# EasyEDA Pro project StimFilterV1.eprj, schematic Schematic1

## Sheets
1 P1: Board Name: Board1; Create Date: 2025-09-26; Page Name: P1; Project Name: StimFilterV1; Schematic Name: Schematic1; Update Date: 2025-09-27; Company: EasyEDA.com; Page Size: A4; Version: V1.0
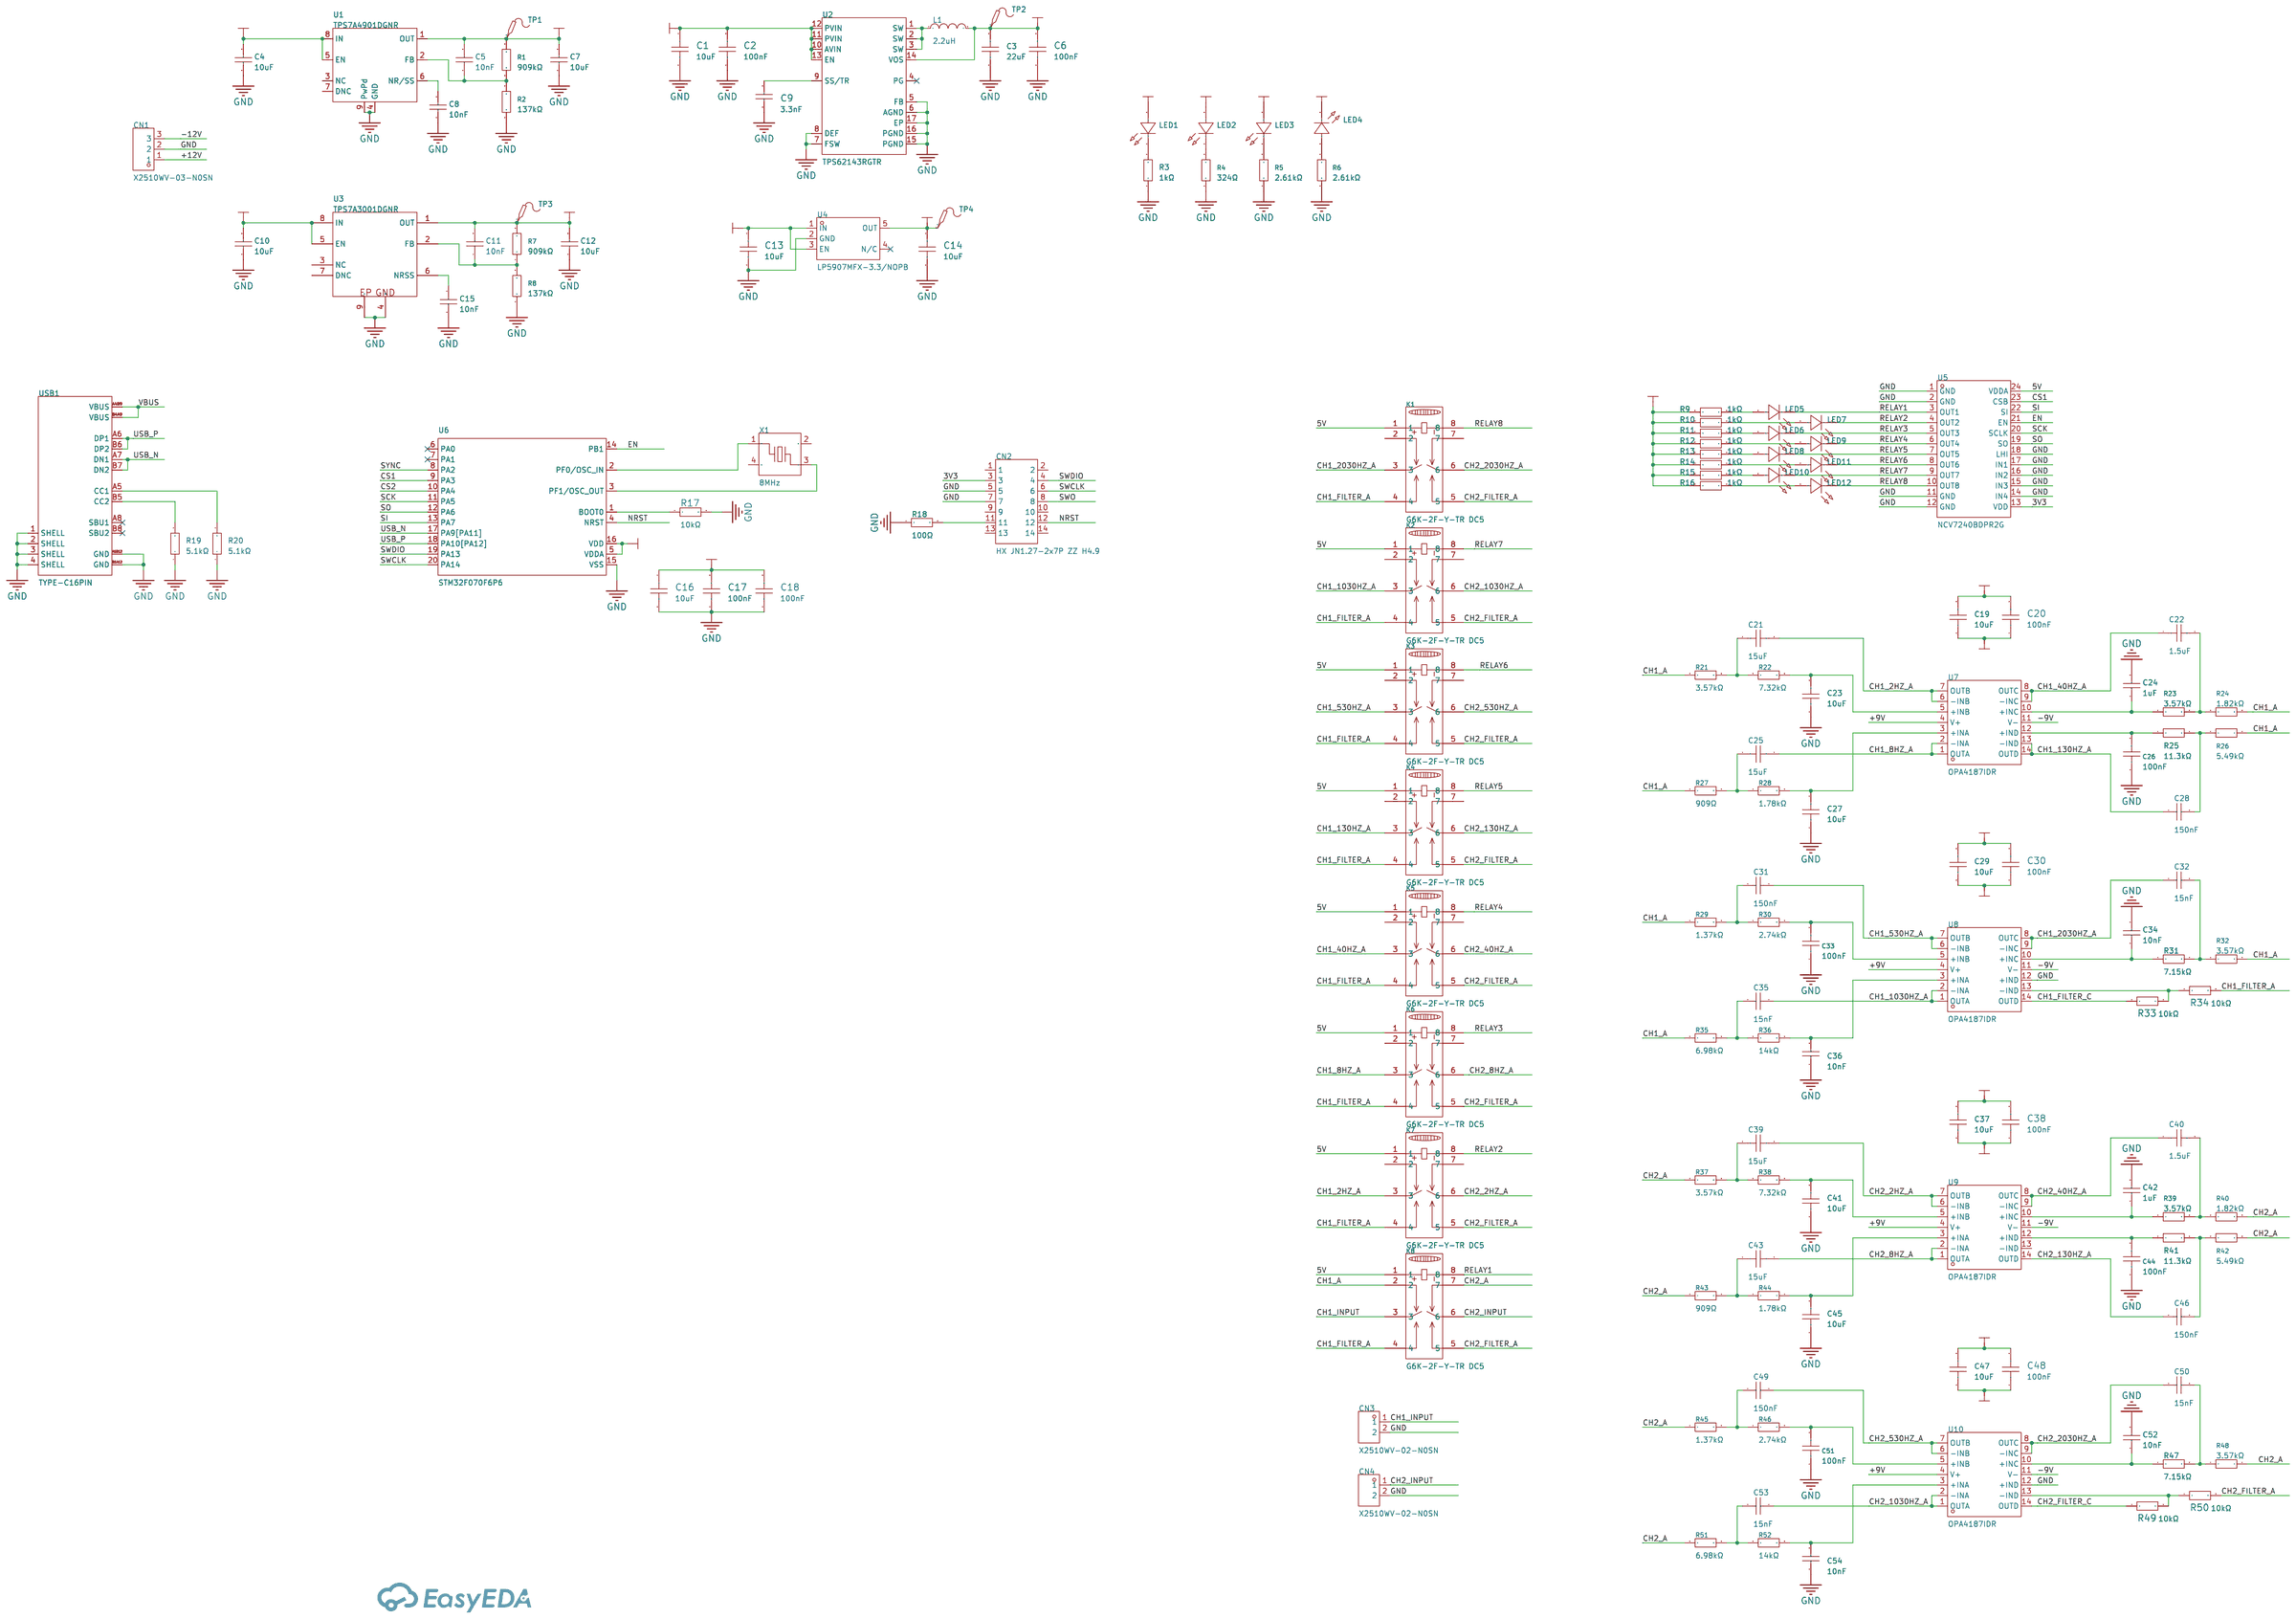
[diagram p0: P1]
2 P2: Create Date: 2025-09-27; Page Name: P2
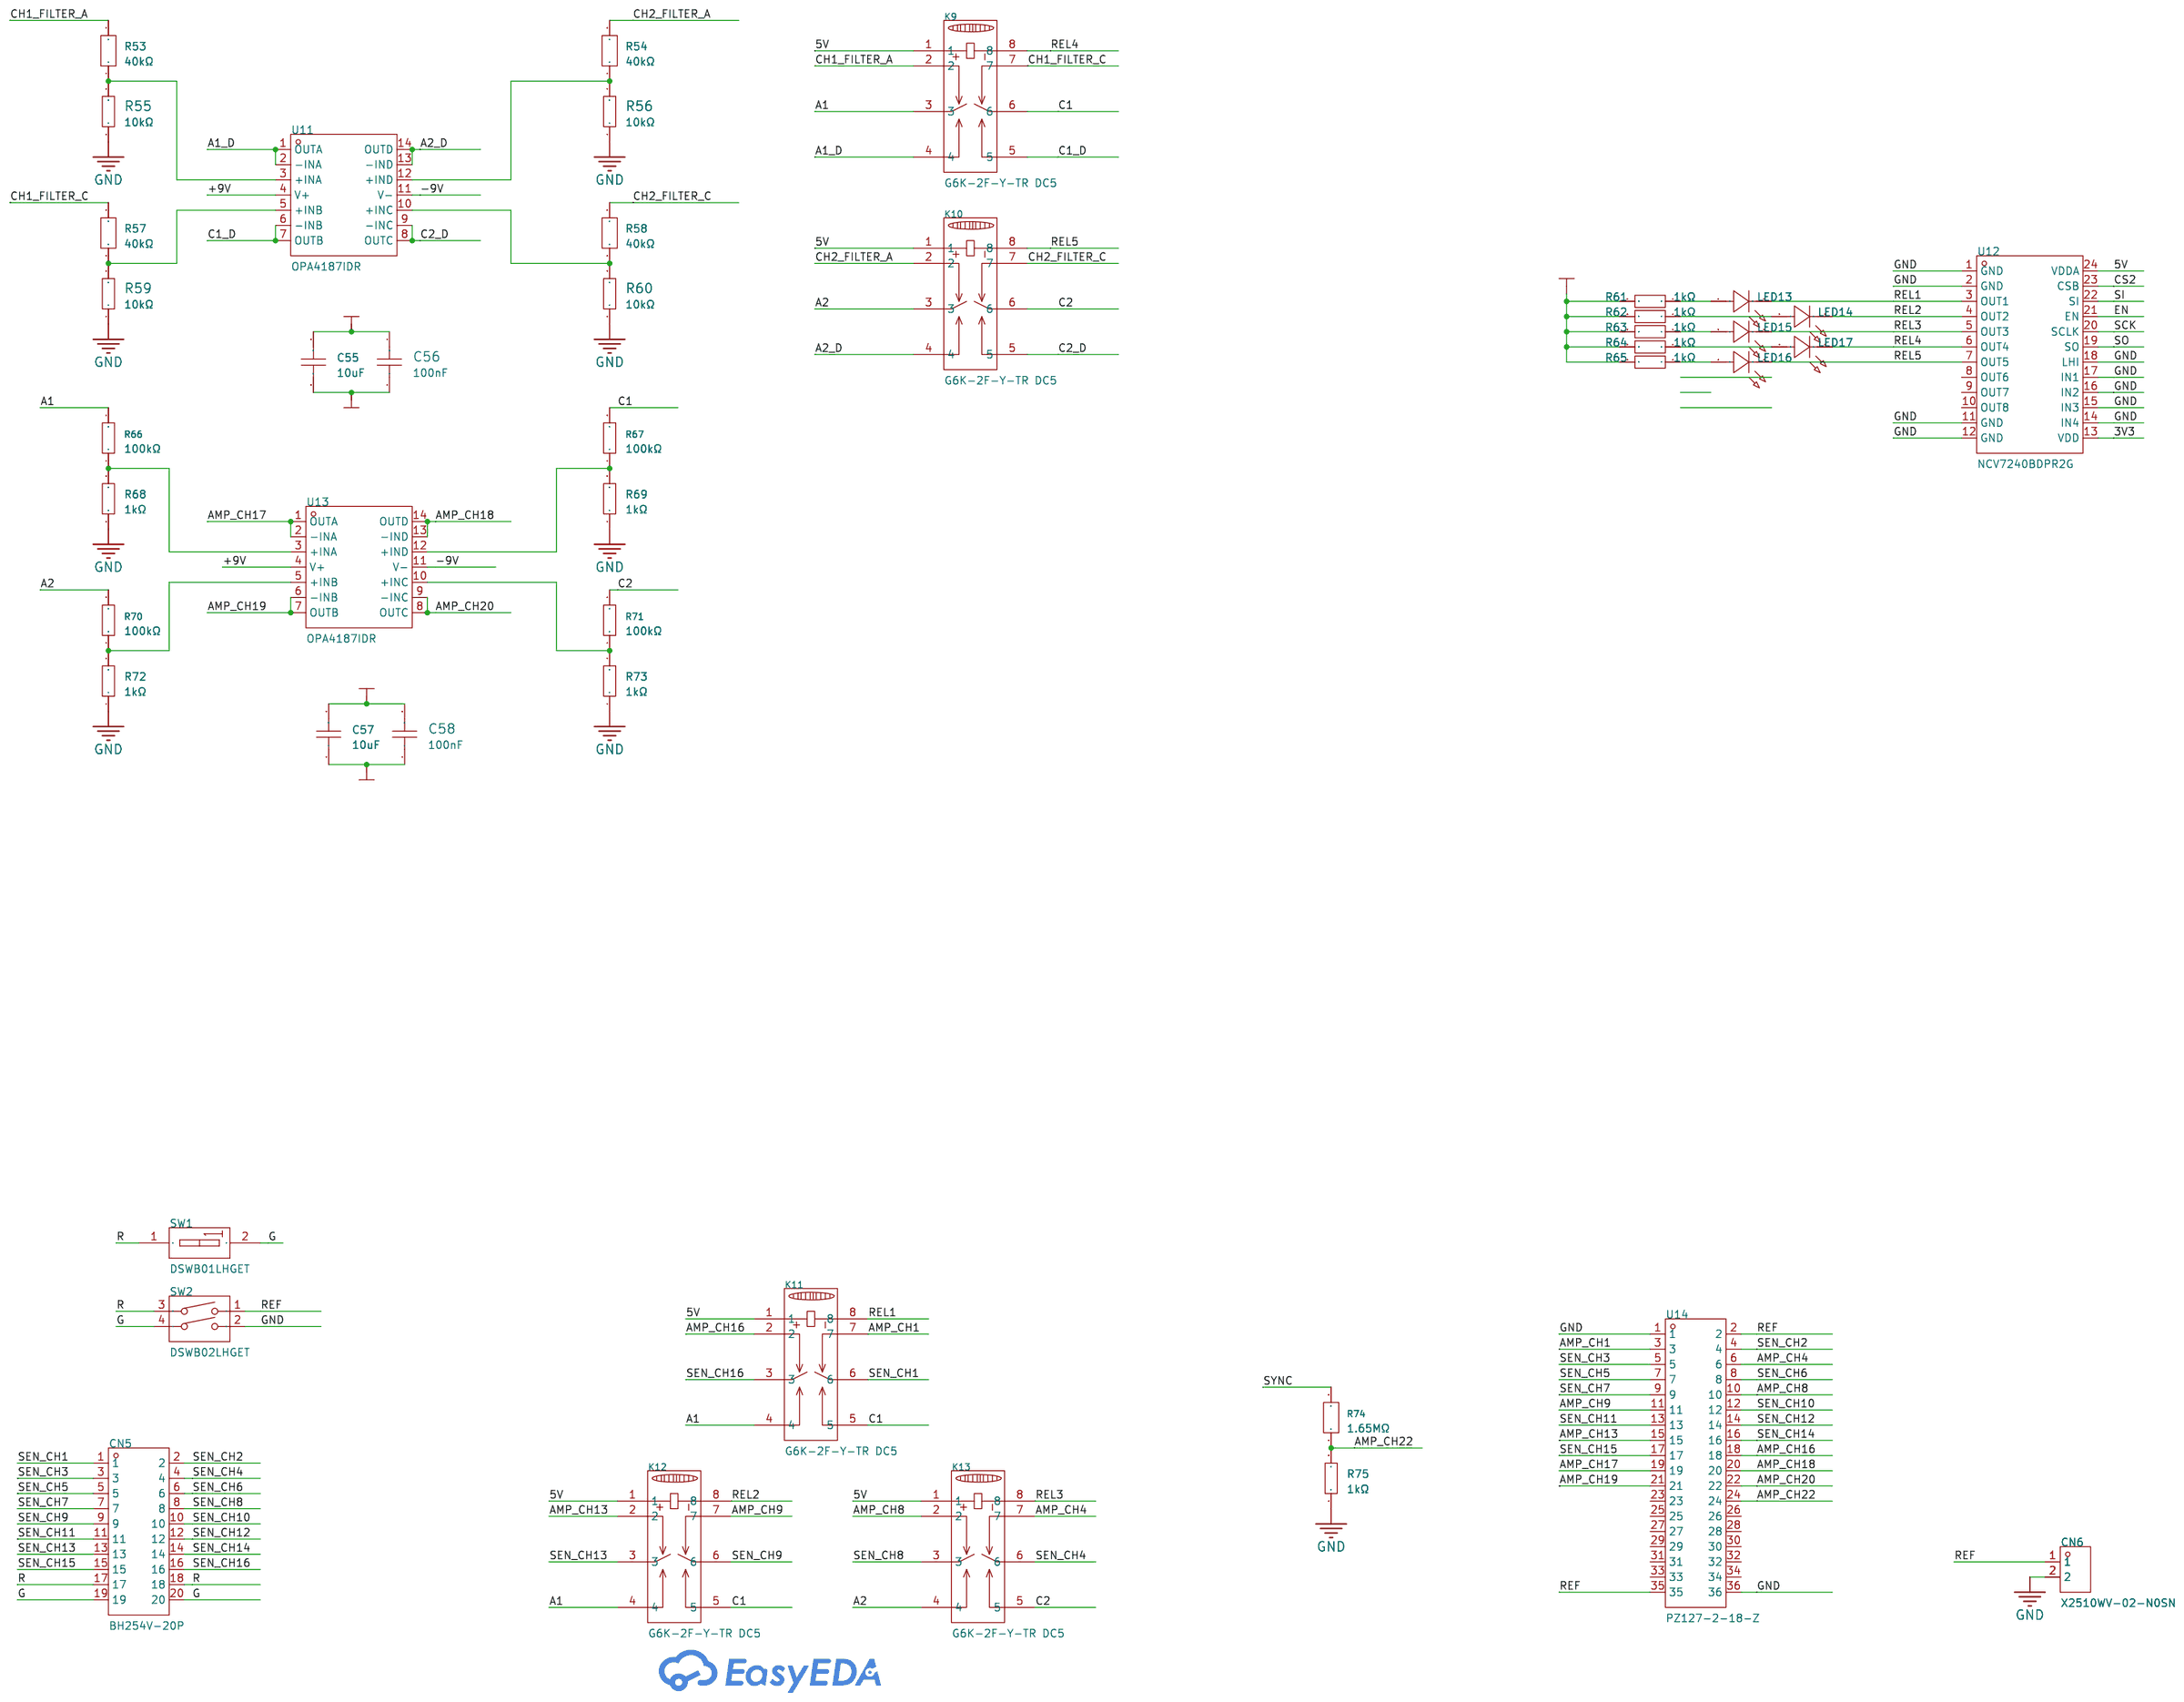
[diagram p1: P2]

## Parts
sheet P1
C1  10uF  [C0603]
C2  100nF  [C0603]
C3  22uF  [C0603]
C4  10uF  [C0805]
C5  10nF  [C0603]
C6  100nF  [C0603]
C7  10uF  [C0805]
C8  10nF  [C0603]
C9  3.3nF  [C0603]
C10  10uF  [C0805]
C11  10nF  [C0603]
C12  10uF  [C0805]
C13  10uF  [C0603]
C14  10uF  [C0603]
C15  10nF  [C0603]
C16  10uF  [C0603]
C17  100nF  [C0603]
C18  100nF  [C0603]
C19  10uF  [C0805]
C20  100nF  [C0603]
C21  15uF  [C0603]
C22  1.5uF  [C0603]
C23  10uF  [C0603]
C24  1uF  [C0603]
C25  15uF  [C0603]
C26  100nF  [C0603]
C27  10uF  [C0603]
C28  150nF  [C0603]
C29  10uF  [C0805]
C30  100nF  [C0603]
C31  150nF  [C0603]
C32  15nF  [C0603]
C33  100nF  [C0603]
C34  10nF  [C0603]
C35  15nF  [C0603]
C36  10nF  [C0603]
C37  10uF  [C0805]
C38  100nF  [C0603]
C39  15uF  [C0603]
C40  1.5uF  [C0603]
C41  10uF  [C0603]
C42  1uF  [C0603]
C43  15uF  [C0603]
C44  100nF  [C0603]
C45  10uF  [C0603]
C46  150nF  [C0603]
C47  10uF  [C0805]
C48  100nF  [C0603]
C49  150nF  [C0603]
C50  15nF  [C0603]
C51  100nF  [C0603]
C52  10nF  [C0603]
C53  15nF  [C0603]
C54  10nF  [C0603]
CN1  X2510WV-03-N0SN  [CONN-TH_3P-X2510WV-0X-N0SN]
CN2  HX JN1.27-2x7P ZZ H4.9  [IDC-TH_14P-P1.27_C42455940]
CN3  X2510WV-02-N0SN  [CONN-TH_2P-X2510WV-02-N0SN]
CN4  X2510WV-02-N0SN  [CONN-TH_2P-X2510WV-02-N0SN]
K1  G6K-2F-Y-TR DC5  [RELAY-SMD_G6K-2F-X-XX]
K2  G6K-2F-Y-TR DC5  [RELAY-SMD_G6K-2F-X-XX]
K3  G6K-2F-Y-TR DC5  [RELAY-SMD_G6K-2F-X-XX]
K4  G6K-2F-Y-TR DC5  [RELAY-SMD_G6K-2F-X-XX]
K5  G6K-2F-Y-TR DC5  [RELAY-SMD_G6K-2F-X-XX]
K6  G6K-2F-Y-TR DC5  [RELAY-SMD_G6K-2F-X-XX]
K7  G6K-2F-Y-TR DC5  [RELAY-SMD_G6K-2F-X-XX]
K8  G6K-2F-Y-TR DC5  [RELAY-SMD_G6K-2F-X-XX]
L1  2.2uH  [L0806]
LED1  A-SP192DGHC-C01-4T  [LED0603-FD]
LED2  A-SP192DGHC-C01-4T  [LED0603-FD]
LED3  A-SP192DGHC-C01-4T  [LED0603-FD]
LED4  A-SP192DGHC-C01-4T  [LED0603-FD]
LED5  A-SP192DGHC-C01-4T  [LED0603-FD]
LED6  A-SP192DGHC-C01-4T  [LED0603-FD]
LED7  A-SP192DGHC-C01-4T  [LED0603-FD]
LED8  A-SP192DGHC-C01-4T  [LED0603-FD]
LED9  A-SP192DGHC-C01-4T  [LED0603-FD]
LED10  A-SP192DGHC-C01-4T  [LED0603-FD]
LED11  A-SP192DGHC-C01-4T  [LED0603-FD]
LED12  A-SP192DGHC-C01-4T  [LED0603-FD]
R1  909kΩ  [R0603]
R2  137kΩ  [R0603]
R3  1kΩ  [R0603]
R4  324Ω  [R0603]
R5  2.61kΩ  [R0603]
R6  2.61kΩ  [R0603]
R7  909kΩ  [R0603]
R8  137kΩ  [R0603]
R9  1kΩ  [R0603]
R10  1kΩ  [R0603]
R11  1kΩ  [R0603]
R12  1kΩ  [R0603]
R13  1kΩ  [R0603]
R14  1kΩ  [R0603]
R15  1kΩ  [R0603]
R16  1kΩ  [R0603]
R17  10kΩ  [R0603]
R18  100Ω  [R0402]
R19  5.1kΩ  [R0603]
R20  5.1kΩ  [R0603]
R21  3.57kΩ  [R0603]
R22  7.32kΩ  [R0603]
R23  3.57kΩ  [R0603]
R24  1.82kΩ  [R0603]
R25  11.3kΩ  [R0603]
R26  5.49kΩ  [R0603]
R27  909Ω  [R0603]
R28  1.78kΩ  [R0603]
R29  1.37kΩ  [R0603]
R30  2.74kΩ  [R0603]
R31  7.15kΩ  [R0603]
R32  3.57kΩ  [R0603]
R33  10kΩ  [R0603]
R34  10kΩ  [R0603]
R35  6.98kΩ  [R0603]
R36  14kΩ  [R0603]
R37  3.57kΩ  [R0603]
R38  7.32kΩ  [R0603]
R39  3.57kΩ  [R0603]
R40  1.82kΩ  [R0603]
R41  11.3kΩ  [R0603]
R42  5.49kΩ  [R0603]
R43  909Ω  [R0603]
R44  1.78kΩ  [R0603]
R45  1.37kΩ  [R0603]
R46  2.74kΩ  [R0603]
R47  7.15kΩ  [R0603]
R48  3.57kΩ  [R0603]
R49  10kΩ  [R0603]
R50  10kΩ  [R0603]
R51  6.98kΩ  [R0603]
R52  14kΩ  [R0603]
TP1  -  [Test-Point-0.5mm]
TP2  -  [Test-Point-0.5mm]
TP3  -  [Test-Point-0.5mm]
TP4  -  [Test-Point-0.5mm]
U1  TPS7A4901DGNR  [HVSSOP-8_L3.0-W3.0-P0.65-LS4.9-BL-EP_DGN0008D]
U2  TPS62143RGTR  [TQFN-16_L3.0-W3.0-P0.50-TL-EP1.7]
U3  TPS7A3001DGNR  [HVSSOP-8_L3.0-W3.0-P0.65-LS4.9-BL-EP_DGN0008D]
U4  LP5907MFX-3.3/NOPB  [SOT-23-5_L3.0-W1.7-P0.95-LS2.8-BR]
U5  NCV7240BDPR2G  [SSOP-24_L8.7-W3.9-P0.65-LS6.0-BL]
U6  STM32F070F6P6  [TSSOP-20_L6.5-W4.4-P0.65-LS6.4-BL]
U7  OPA4187IDR  [SOIC-14_L8.7-W3.9-P1.27-LS6.0-BL]
U8  OPA4187IDR  [SOIC-14_L8.7-W3.9-P1.27-LS6.0-BL]
U9  OPA4187IDR  [SOIC-14_L8.7-W3.9-P1.27-LS6.0-BL]
U10  OPA4187IDR  [SOIC-14_L8.7-W3.9-P1.27-LS6.0-BL]
USB1  TYPE-C16PIN  [USB-C-SMD_TYPE-C16PIN]
X1  8MHz  [CRYSTAL-SMD_4P-L3.2-W2.5-BL]
sheet P2
C55  10uF  [C0805]
C56  100nF  [C0603]
C57  10uF  [C0805]
C58  100nF  [C0603]
CN5  BH254V-20P  [CONN-TH_20P-P2.54_0702462001]
CN6  X2510WV-02-N0SN  [CONN-TH_2P-X2510WV-02-N0SN]
K9  G6K-2F-Y-TR DC5  [RELAY-SMD_G6K-2F-X-XX]
K10  G6K-2F-Y-TR DC5  [RELAY-SMD_G6K-2F-X-XX]
K11  G6K-2F-Y-TR DC5  [RELAY-SMD_G6K-2F-X-XX]
K12  G6K-2F-Y-TR DC5  [RELAY-SMD_G6K-2F-X-XX]
K13  G6K-2F-Y-TR DC5  [RELAY-SMD_G6K-2F-X-XX]
LED13  A-SP192DGHC-C01-4T  [LED0603-FD]
LED14  A-SP192DGHC-C01-4T  [LED0603-FD]
LED15  A-SP192DGHC-C01-4T  [LED0603-FD]
LED16  A-SP192DGHC-C01-4T  [LED0603-FD]
LED17  A-SP192DGHC-C01-4T  [LED0603-FD]
R53  40kΩ  [R0603]
R54  40kΩ  [R0603]
R55  10kΩ  [R0603]
R56  10kΩ  [R0603]
R57  40kΩ  [R0603]
R58  40kΩ  [R0603]
R59  10kΩ  [R0603]
R60  10kΩ  [R0603]
R61  1kΩ  [R0603]
R62  1kΩ  [R0603]
R63  1kΩ  [R0603]
R64  1kΩ  [R0603]
R65  1kΩ  [R0603]
R66  100kΩ  [R0603]
R67  100kΩ  [R0603]
R68  1kΩ  [R0603]
R69  1kΩ  [R0603]
R70  100kΩ  [R0603]
R71  100kΩ  [R0603]
R72  1kΩ  [R0603]
R73  1kΩ  [R0603]
R74  1.65MΩ  [R0603]
R75  1kΩ  [R0603]
SW1  DSWB01LHGET  [SW-TH_DSWB01LHGETR]
SW2  DSWB02LHGET  [SW-TH_DSWB02LHGET]
U11  OPA4187IDR  [SOIC-14_L8.7-W3.9-P1.27-LS6.0-BL]
U12  NCV7240BDPR2G  [SSOP-24_L8.7-W3.9-P0.65-LS6.0-BL]
U13  OPA4187IDR  [SOIC-14_L8.7-W3.9-P1.27-LS6.0-BL]
U14  PZ127-2-18-Z  [HDR-TH_36P-P1.27-V-M-R2-C18-S1.27]

## Library data of the parts
C1 C13 C14 C16 = GRM188R61E106KA73D: Capacitance: Tolerance:±10% Tolerance:±10% Voltage Rated: Temperature Coefficient:; LCSC Part Name: 10uF ±10% 25V; Supplier Part: C344022; Manufacturer: muRata(村田); Supplier Footprint: 0603; JLCPCB Part Class: Extended Part; Datasheet: https://atta.szlcsc.com/upload/public/pdf/source/20181211/C344022_BB98D43E7DA95E5A749FBFE073C8A3E0.pdf; Supplier: LCSC; Tolerance: ±10%
C2 C6 C17 C18 C20 C30 C38 C48 C56 C58 = CC0603KRX7R9BB104: Capacitance: Tolerance:±10% Tolerance:±10% Voltage Rated: Temperature Coefficient:; LCSC Part Name: 100nF ±10% 50V; Supplier Part: C14663; Manufacturer: YAGEO(国巨); Supplier Footprint: 0603; JLCPCB Part Class: Basic Part; Datasheet: https://atta.szlcsc.com/upload/public/pdf/source/20180910/C282072_33301C7F631E79921B82A8DAC6BCC5B3.pdf; Supplier: LCSC; Tolerance: ±10%
C3 = CL10A226MP8NUNE: Capacitance: Tolerance:±20% Tolerance:±20% Voltage Rated: Temperature Coefficient:; LCSC Part Name: 22uF ±20% 10V; Supplier Part: C86295; Manufacturer: SAMSUNG(三星); Supplier Footprint: 0603; JLCPCB Part Class: Extended Part; Datasheet: https://atta.szlcsc.com/upload/public/pdf/source/20160218/1457707763339.pdf; Supplier: LCSC; Tolerance: ±20%
C4 C7 C10 C12 = CL21B106KPQNNNE: LCSC Part Name: 10uF ±10% 10V; Supplier Part: C32635; Manufacturer: SAMSUNG(三星); Supplier Footprint: 0805; JLCPCB Part Class: Extended Part; Datasheet: https://item.szlcsc.com/datasheet/CL21B106KPQNNNE/33600.html; Supplier: LCSC; Tolerance: ±10%; Voltage Rating: 10V; Temperature Coefficient: X7R
C5 C8 C11 C15 C34 C36 C52 C54 = CL10B103KB8NNNC: LCSC Part Name: 10nF ±10% 50V; Supplier Part: C1589; Manufacturer: SAMSUNG(三星); Supplier Footprint: 0603; JLCPCB Part Class: Extended Part; Datasheet: https://item.szlcsc.com/datasheet/CL10B103KB8NNNC/1941.html; Supplier: LCSC; Tolerance: ±10%; Voltage Rating: 50V; Temperature Coefficient: X7R
C9 = CC0603KRX7R9BB332: Capacitance: Tolerance:±10% Tolerance:±10% Voltage Rated: Temperature Coefficient:; LCSC Part Name: 3.3nF ±10% 50V; Supplier Part: C107088; Manufacturer: YAGEO(国巨); Supplier Footprint: 0603; JLCPCB Part Class: Extended Part; Datasheet: https://atta.szlcsc.com/upload/public/pdf/source/20180910/C282072_33301C7F631E79921B82A8DAC6BCC5B3.pdf; Supplier: LCSC; Tolerance: ±10%
C19 C29 C37 C47 C55 C57 = CL21A106KAYNNNE_C15850: LCSC Part Name: 10uF ±10% 25V; Supplier Part: C15850; Manufacturer: SAMSUNG(三星); Manufacturer Part: CL21A106KAYNNNE; Supplier Footprint: 0805; JLCPCB Part Class: Basic Part; Datasheet: https://item.szlcsc.com/datasheet/CL21A106KAYNNNE/16532.html; Supplier: LCSC; Tolerance: ±10%; Voltage Rating: 25V; Temperature Coefficient: X5R
C21 C25 C39 C43 = C1608X5R0J156MT000E: LCSC Part Name: 15uF ±20% 6.3V; Supplier Part: C445715; Manufacturer: TDK; Supplier Footprint: 0603; JLCPCB Part Class: Extended Part; Datasheet: https://atta.szlcsc.com/upload/public/pdf/source/20191108/C445765_930F403C9F9F1C91FA65B6959DB97EFA.pdf; Supplier: LCSC; Tolerance: ±20%; Voltage Rating: 6.3V; Temperature Coefficient: X5R
C22 C40 = C1608X7R1A155KT000E: LCSC Part Name: 1.5uF ±10% 10V; Supplier Part: C361193; Manufacturer: TDK; Supplier Footprint: 0603; JLCPCB Part Class: Extended Part; Datasheet: https://item.szlcsc.com/datasheet/C1608X7R1A155KT000E/336024.html; Supplier: LCSC; Tolerance: ±10%; Voltage Rating: 10V; Temperature Coefficient: X7R
C23 C27 C41 C45 = CL10A106KP8NNNC: LCSC Part Name: 10uF ±10% 10V; Supplier Part: C19702; Manufacturer: SAMSUNG(三星); Supplier Footprint: 0603; JLCPCB Part Class: Basic Part; Datasheet: https://item.szlcsc.com/datasheet/CL10A106KP8NNNC/20411.html; Supplier: LCSC; Tolerance: ±10%; Voltage Rating: 10V; Temperature Coefficient: X5R
C24 C42 = CL10A105KO8NNNC: LCSC Part Name: 1uF ±10% 16V; Supplier Part: C1592; Manufacturer: SAMSUNG(三星); Supplier Footprint: 0603; JLCPCB Part Class: Extended Part; Datasheet: https://item.szlcsc.com/datasheet/CL10A105KO8NNNC/1944.html; Supplier: LCSC; Tolerance: ±10%; Voltage Rating: 16V; Temperature Coefficient: X5R
C26 C33 C44 C51 = CL10B104KB8NNNC: LCSC Part Name: 100nF ±10% 50V; Supplier Part: C1591; Manufacturer: SAMSUNG(三星); Supplier Footprint: 0603; JLCPCB Part Class: Extended Part; Datasheet: https://item.szlcsc.com/datasheet/CL10B104KB8NNNC/1943.html; Supplier: LCSC; Tolerance: ±10%; Voltage Rating: 50V; Temperature Coefficient: X7R
C28 C31 C46 C49 = 0603B154K500NT: LCSC Part Name: 150nF ±10% 50V; Supplier Part: C1597; Manufacturer: FH(风华); Supplier Footprint: 0603; JLCPCB Part Class: Extended Part; Datasheet: https://item.szlcsc.com/datasheet/0603B154K500NT/1949.html; Supplier: LCSC; Tolerance: ±10%; Voltage Rating: 50V; Temperature Coefficient: X7R
C32 C35 C50 C53 = 0603B153K500NT: LCSC Part Name: 15nF ±10% 50V; Supplier Part: C1596; Manufacturer: FH(风华); Supplier Footprint: 0603; JLCPCB Part Class: Extended Part; Datasheet: https://item.szlcsc.com/datasheet/0603B153K500NT/1948.html; Supplier: LCSC; Tolerance: ±10%; Voltage Rating: 50V; Temperature Coefficient: X7R
CN1 = X2510WV-03-N0SN: LCSC Part Name: 1x3P 间距:2.54mm 直插; Supplier Part: C843332; Manufacturer: XKB Connection(中国星坤); Supplier Footprint: 插件,P=2.54mm; JLCPCB Part Class: Extended Part; Datasheet: https://item.szlcsc.com/datasheet/X2510WV-03-N0SN/902334.html; Supplier: LCSC; Pins Structure: 1x3P; Pitch: 2.54mm; Mounting Type: Through Hole; Number of Pins: 3P; Number of Rows: 1; Number of PINs Per Row: 3; Current Rating: 3A; Contact Material: Brass; Contact Plating: Tin
CN2 = HX JN1.27-2x7P ZZ H4.9: Connector Type:Simple cow constellation Pitch:1.27mm Number of Positions or Pins:2x7P Current Rating:1A Voltage Rating (Max):- Holder Type:Direct Insert Row Spacing:1.27mm Number of Rows:2 Number of PINs Per Row:7 Contact Material:Brass Contact Plating:Go; LCSC Part Name: 1.27mm 2x7P 排数:2 每排P数:7; Supplier Part: C42455940; Manufacturer: hanxia(韩下); Supplier Footprint: 插件,P=1.27mm; JLCPCB Part Class: Extended Part; Datasheet: https://atta.szlcsc.com/upload/public/pdf/source/20250221/BE511331B0ED89F35B37590A51D7581D.pdf; Supplier: LCSC; Connector Type: Simple cow constellation; Pitch: 1.27mm; Number of Positions or Pins: 2x7P; Current Rating: 1A; Holder Type: Direct Insert; Row Spacing: 1.27mm; Number of Rows: 2; Number of PINs Per Row: 7; Contact Material: Brass; Contact Plating: Gold; Operating Temperature: -40℃~+105℃; Color: Black
CN3 CN4 CN6 = X2510WV-02-N0SN: LCSC Part Name: 1x2P 间距:2.54mm 直插; Supplier Part: C843331; Manufacturer: XKB Connection(中国星坤); Supplier Footprint: 插件,P=2.54mm; JLCPCB Part Class: Extended Part; Datasheet: https://item.szlcsc.com/datasheet/X2510WV-02-N0SN/902333.html; Supplier: LCSC; Pins Structure: 1x2P; Pitch: 2.54mm; Mounting Type: Through Hole; Number of Pins: 2P; Number of Rows: 1; Number of PINs Per Row: 2; Current Rating: 3A; Contact Material: Brass; Contact Plating: Tin
K1-K13 = G6K-2F-Y-TR DC5: Coil Voltage:5V Contact Form:两组转换:2C(DPDT-转换) Pin Number:- Contact Rating:- Maximum Switching Voltage:125V@AC；60V@DC Contact Material:silver+Gold plating Coil Resistance:- Maximum Switching Current:1A Operate Time:3ms Release Time:3ms Coil Type:- Contact; Supplier Part: C47190; Manufacturer: OMRON(欧姆龙); Supplier Footprint: SMD,6.5x10mm; JLCPCB Part Class: Extended Part; Datasheet: https://atta.szlcsc.com/upload/public/pdf/source/20220125/C1876770_53E5491D4B68F29C4BBD8118E9BAE0E8.pdf; Supplier: LCSC; Coil Voltage: 5V; Contact Form: 两组转换:2C(DPDT-转换); Maximum Switching Voltage: 125V@AC；60V@DC; Contact Material: silver+Gold plating; Maximum Switching Current: 1A; Operate Time: 3ms; Release Time: 3ms; Operating Temperature: -40℃~+70℃
L1 = TFM201610ALM-2R2MTAA: Inductance: Tolerance:±20% Tolerance:±20% Rated Current: Saturation Current (Isat): DC Resistance (DCR): Q @ Freq:- Frequency - Self Resonant:- Ratings: Type:薄膜电感; LCSC Part Name: 2.2uH ±20% 2.6A; Supplier Part: C695610; Manufacturer: TDK; Supplier Footprint: SMD,1.6x2mm; JLCPCB Part Class: Extended Part; Datasheet: https://atta.szlcsc.com/upload/public/pdf/source/20200701/C695610_120766AA8A1DDB2653DCF4E54815F57C.pdf; Supplier: LCSC; Tolerance: ±20%; Type: 薄膜电感
LED1-LED17 = A-SP192DGHC-C01-4T: Emitted Color:Green Forward Voltage (VF):2.4V~3V Forward Voltage (VF):2.4V~3V Power Dissipation:70mW Dominant Wavelength:520nm~535nm Dominant Wavelength:520nm~535nm Lens Color:Colorless Transparent Lens Luminous Intensity:225mcd~450mcd Luminous Intensity:; LCSC Part Name: 0603高亮绿灯正贴; Supplier Part: C19171301; Manufacturer: Amicc(欧密格光电); Supplier Footprint: 0603; JLCPCB Part Class: Extended Part; Datasheet: https://atta.szlcsc.com/upload/public/pdf/source/20231108/CAA90604E374CB6B31BBE970B55159E7.pdf; Supplier: LCSC; Emitted Color: Green; Forward Voltage (VF): 2.4V~3V; Power Dissipation: 70mW; Dominant Wavelength: 520nm~535nm; Lens Color: Colorless Transparent Lens; Luminous Intensity: 225mcd~450mcd; Viewing Angle: 120°; Mounting Sytle: Positive Stick; Operating Temperature: -40℃~+85℃
R1 R7 = 0603WAF9093T5E: LCSC Part Name: 909kΩ ±1% 100mW 厚膜电阻; Supplier Part: C23262; Manufacturer: UNI-ROYAL(厚声); Supplier Footprint: 0603; JLCPCB Part Class: Extended Part; Datasheet: https://item.szlcsc.com/datasheet/0603WAF9093T5E/23989.html; Supplier: LCSC; Type: Thick Film Resistor; Tolerance: ±1%; Power(Watts): 100mW; Voltage-Supply(Max): 75V; Temperature Coefficient: ±100ppm/℃; Operating Temperature: -55℃~+155℃
R2 R8 = 0603WAF1373T5E: LCSC Part Name: 137kΩ ±1% 100mW 厚膜电阻; Supplier Part: C22872; Manufacturer: UNI-ROYAL(厚声); Supplier Footprint: 0603; JLCPCB Part Class: Extended Part; Datasheet: https://item.szlcsc.com/datasheet/0603WAF1373T5E/23599.html; Supplier: LCSC; Type: Thick Film Resistors; Tolerance: ±1%; Power(Watts): 0.1W; Voltage-Supply(Max): 75V; Temperature Coefficient: ±100ppm/℃; Operating Temperature: -55℃~+155℃
R3 R9-R16 R61-R65 R68 R69 R72 R73 R75 = 0603WAF1001T5E: LCSC Part Name: 1kΩ ±1% 100mW 厚膜电阻; Supplier Part: C21190; Manufacturer: UNI-ROYAL(厚声); Supplier Footprint: 0603; JLCPCB Part Class: Basic Part; Datasheet: https://atta.szlcsc.com/upload/public/pdf/source/20200306/C422600_1E6D84923E4A46A82E41ADD87F860B5C.pdf; Supplier: LCSC; Type: Thick Film Resistors; Tolerance: ±1%; Temperature Coefficient: ±100ppm/℃; Operating Temperature Range: -55℃~+155℃
R4 = RTT033240FTP: LCSC Part Name: 厚膜电阻 324Ω ±1% 100mW; Supplier Part: C12963; Manufacturer: RALEC(旺诠); Supplier Footprint: 0603; JLCPCB Part Class: Extended Part; Datasheet: https://atta.szlcsc.com/upload/public/pdf/source/20180928/C303758_52AE496EA05AD4D633595C32F5A0EBAF.pdf; Supplier: LCSC; Type: Thick Film Resistors; Tolerance: ±1%; Temperature Coefficient: ±100ppm/℃; Operating Temperature Range: -55℃~+155℃
R5 R6 = 0603WAF2611T5E: LCSC Part Name: 2.61kΩ ±1% 100mW 厚膜电阻; Supplier Part: C22942; Manufacturer: UNI-ROYAL(厚声); Supplier Footprint: 0603; JLCPCB Part Class: Extended Part; Datasheet: https://item.szlcsc.com/datasheet/0603WAF2611T5E/23669.html; Supplier: LCSC; Type: Thick Film Resistor; Tolerance: ±1%; Power(Watts): 100mW; Voltage-Supply(Max): 75V; Temperature Coefficient: ±100ppm/℃; Operating Temperature: -55℃~+155℃
R17 R33 R34 R49 R50 R55 R56 R59 R60 = 0603WAF1002T5E: Type:Thick Film Resistors Resistance:10kΩ Tolerance:±1% Tolerance:±1% Power(Watts): Overload Voltage (Max): Temperature Coefficient:±100ppm/℃ Temperature Coefficient:±100ppm/℃ Operating Temperature Range:-55℃~+155℃ Operating Temperature Range:-55℃~+155℃; LCSC Part Name: 厚膜电阻 10kΩ ±1% 100mW; Supplier Part: C25804; Manufacturer: UNI-ROYAL(厚声); Supplier Footprint: 0603; JLCPCB Part Class: Basic Part; Datasheet: https://atta.szlcsc.com/upload/public/pdf/source/20200306/C422600_1E6D84923E4A46A82E41ADD87F860B5C.pdf; Supplier: LCSC; Type: Thick Film Resistors; Tolerance: ±1%; Temperature Coefficient: ±100ppm/℃; Operating Temperature Range: -55℃~+155℃
R18 = RC0402FR-07100RL: Type:Thick Film Resistors Resistance: Tolerance:±1% Tolerance:±1% Power(Watts): Overload Voltage (Max): Temperature Coefficient:±100ppm/℃ Temperature Coefficient:±100ppm/℃ Operating Temperature Range:-55℃~+155℃ Operating Temperature Range:-55℃~+155℃; LCSC Part Name: 厚膜电阻 100Ω ±1% 62.5mW; Supplier Part: C106232; Manufacturer: YAGEO(国巨); Supplier Footprint: 0402; JLCPCB Part Class: Extended Part; Datasheet: https://atta.szlcsc.com/upload/public/pdf/source/20180927/C295883_E8D83085EA81BD7DE0B2B681138C15EE.pdf; Supplier: LCSC; Type: Thick Film Resistors; Tolerance: ±1%; Temperature Coefficient: ±100ppm/℃; Operating Temperature Range: -55℃~+155℃
R19 R20 = 0603WAF5101T5E: Type:Thick Film Resistors Resistance:5.1kΩ Tolerance:±1% Tolerance:±1% Power(Watts): Overload Voltage (Max): Temperature Coefficient:±100ppm/℃ Temperature Coefficient:±100ppm/℃ Operating Temperature Range:-55℃~+155℃ Operating Temperature Range:-55℃~+155℃; LCSC Part Name: 5.1kΩ ±1% 100mW 厚膜电阻; Supplier Part: C23186; Manufacturer: UNI-ROYAL(厚声); Supplier Footprint: 0603; JLCPCB Part Class: Basic Part; Datasheet: https://atta.szlcsc.com/upload/public/pdf/source/20200306/C422600_1E6D84923E4A46A82E41ADD87F860B5C.pdf; Supplier: LCSC; Type: Thick Film Resistors; Tolerance: ±1%; Temperature Coefficient: ±100ppm/℃; Operating Temperature Range: -55℃~+155℃
R21 R23 R32 R37 R39 R48 = 0603WAF3571T5E: LCSC Part Name: 3.57kΩ ±1% 100mW 厚膜电阻; Supplier Part: C22998; Manufacturer: UNI-ROYAL(厚声); Supplier Footprint: 0603; JLCPCB Part Class: Extended Part; Datasheet: https://item.szlcsc.com/datasheet/0603WAF3571T5E/23725.html; Supplier: LCSC; Type: Thick Film Resistor; Tolerance: ±1%; Power(Watts): 100mW; Voltage-Supply(Max): 75V; Temperature Coefficient: ±100ppm/℃; Operating Temperature: -55℃~+155℃
R22 R38 = 0603WAF7321T5E: LCSC Part Name: 7.32kΩ ±1% 100mW 厚膜电阻; Supplier Part: C23101; Manufacturer: UNI-ROYAL(厚声); Supplier Footprint: 0603; JLCPCB Part Class: Extended Part; Datasheet: https://item.szlcsc.com/datasheet/0603WAF7321T5E/23828.html; Supplier: LCSC; Type: Thick Film Resistor; Tolerance: ±1%; Power(Watts): 100mW; Voltage-Supply(Max): 75V; Temperature Coefficient: ±100ppm/℃; Operating Temperature: -55℃~+155℃
R24 R40 = 0603WAF1821T5E: LCSC Part Name: 1.82kΩ ±1% 100mW 厚膜电阻; Supplier Part: C25958; Manufacturer: UNI-ROYAL(厚声); Supplier Footprint: 0603; JLCPCB Part Class: Extended Part; Datasheet: https://item.szlcsc.com/datasheet/0603WAF1821T5E/26701.html; Supplier: LCSC; Type: Thick Film Resistor; Tolerance: ±1%; Power(Watts): 100mW; Voltage-Supply(Max): 75V; Temperature Coefficient: ±100ppm/℃; Operating Temperature: -55℃~+155℃
R25 R41 = 0603WAF1132T5E: LCSC Part Name: 11.3kΩ ±1% 100mW 厚膜电阻; Supplier Part: C22860; Manufacturer: UNI-ROYAL(厚声); Supplier Footprint: 0603; JLCPCB Part Class: Extended Part; Datasheet: https://item.szlcsc.com/datasheet/0603WAF1132T5E/23587.html; Supplier: LCSC; Type: Thick Film Resistor; Tolerance: ±1%; Power(Watts): 100mW; Voltage-Supply(Max): 75V; Temperature Coefficient: ±100ppm/℃; Operating Temperature: -55℃~+155℃
R26 R42 = RTT035491FTP: LCSC Part Name: 厚膜电阻 5.49kΩ ±1% 100mW; Supplier Part: C13244; Manufacturer: RALEC(旺诠); Supplier Footprint: 0603; JLCPCB Part Class: Extended Part; Datasheet: https://atta.szlcsc.com/upload/public/pdf/source/20180928/C303758_52AE496EA05AD4D633595C32F5A0EBAF.pdf; Supplier: LCSC; Type: Thick Film Resistors; Tolerance: ±1%; Temperature Coefficient: ±100ppm/℃; Operating Temperature Range: -55℃~+155℃
R27 R43 = RTT039090FTP: LCSC Part Name: 厚膜电阻 909Ω ±1% 100mW; Supplier Part: C13050; Manufacturer: RALEC(旺诠); Supplier Footprint: 0603; JLCPCB Part Class: Extended Part; Datasheet: https://atta.szlcsc.com/upload/public/pdf/source/20180928/C303758_52AE496EA05AD4D633595C32F5A0EBAF.pdf; Supplier: LCSC; Type: Thick Film Resistors; Tolerance: ±1%; Temperature Coefficient: ±100ppm/℃; Operating Temperature Range: -55℃~+155℃
R28 R44 = RTT031781FTP: LCSC Part Name: 厚膜电阻 1.78kΩ ±1% 100mW; Supplier Part: C13118; Manufacturer: RALEC(旺诠); Supplier Footprint: 0603; JLCPCB Part Class: Extended Part; Datasheet: https://atta.szlcsc.com/upload/public/pdf/source/20180928/C303758_52AE496EA05AD4D633595C32F5A0EBAF.pdf; Supplier: LCSC; Type: Thick Film Resistors; Tolerance: ±1%; Temperature Coefficient: ±100ppm/℃; Operating Temperature Range: -55℃~+155℃
R29 R45 = 0603WAF1371T5E: LCSC Part Name: 1.37kΩ ±1% 100mW 厚膜电阻; Supplier Part: C22839; Manufacturer: UNI-ROYAL(厚声); Supplier Footprint: 0603; JLCPCB Part Class: Extended Part; Datasheet: https://item.szlcsc.com/datasheet/0603WAF1371T5E/23566.html; Supplier: LCSC; Type: Thick Film Resistor; Tolerance: ±1%; Power(Watts): 100mW; Voltage-Supply(Max): 75V; Temperature Coefficient: ±100ppm/℃; Operating Temperature: -55℃~+155℃
R30 R46 = 0603WAF2741T5E: LCSC Part Name: 2.74kΩ ±1% 100mW 厚膜电阻; Supplier Part: C22944; Manufacturer: UNI-ROYAL(厚声); Supplier Footprint: 0603; JLCPCB Part Class: Extended Part; Datasheet: https://item.szlcsc.com/datasheet/0603WAF2741T5E/23671.html; Supplier: LCSC; Type: Thick Film Resistor; Tolerance: ±1%; Power(Watts): 100mW; Voltage-Supply(Max): 75V; Temperature Coefficient: ±100ppm/℃; Operating Temperature: -55℃~+155℃
R31 R47 = 0603WAF7151T5E: LCSC Part Name: 7.15kΩ ±1% 100mW 厚膜电阻; Supplier Part: C25980; Manufacturer: UNI-ROYAL(厚声); Supplier Footprint: 0603; JLCPCB Part Class: Extended Part; Datasheet: https://item.szlcsc.com/datasheet/0603WAF7151T5E/26723.html; Supplier: LCSC; Type: Thick Film Resistor; Tolerance: ±1%; Power(Watts): 100mW; Voltage-Supply(Max): 75V; Temperature Coefficient: ±100ppm/℃; Operating Temperature: -55℃~+155℃
R35 R51 = 0603WAF6981T5E: LCSC Part Name: 6.98kΩ ±1% 100mW 厚膜电阻; Supplier Part: C23215; Manufacturer: UNI-ROYAL(厚声); Supplier Footprint: 0603; JLCPCB Part Class: Extended Part; Datasheet: https://item.szlcsc.com/datasheet/0603WAF6981T5E/23942.html; Supplier: LCSC; Type: Thick Film Resistor; Tolerance: ±1%; Power(Watts): 100mW; Voltage-Supply(Max): 75V; Temperature Coefficient: ±100ppm/℃; Operating Temperature: -55℃~+155℃
R36 R52 = 0603WAF1402T5E: LCSC Part Name: 14kΩ ±1% 100mW 厚膜电阻; Supplier Part: C22803; Manufacturer: UNI-ROYAL(厚声); Supplier Footprint: 0603; JLCPCB Part Class: Extended Part; Datasheet: https://item.szlcsc.com/datasheet/0603WAF1402T5E/23530.html; Supplier: LCSC; Type: Thick Film Resistor; Tolerance: ±1%; Power(Watts): 100mW; Voltage-Supply(Max): 75V; Temperature Coefficient: ±100ppm/℃; Operating Temperature: -55℃~+155℃
TP1-TP4 = Test-Point
U1 = TPS7A4901DGNR: Output Type:Adjustable Maximum Input Voltage:35V Output Voltage:1.194V~33V Output Voltage:1.194V~33V Output Current:150mA Power Supply Rejection Ratio (PSRR):78dB@(1kHz) Dropout Voltage:450mV@(1A) standby current:100uA Feature:ESD Protection；Low ESR；Therm; LCSC Part Name: 具有使能功能的 150mA、36V、低噪声、高 PSRR、可调节低压降稳压器; Supplier Part: C16430; Manufacturer: TI(德州仪器); Supplier Footprint: HVSSOP-8; JLCPCB Part Class: Extended Part; Datasheet: https://www.ti.com/cn/lit/gpn/tps7a49; Supplier: LCSC; Output Type: Adjustable; Maximum Input Voltage: 35V; Output Voltage: 1.194V~33V; Output Current: 150mA; Power Supply Rejection Ratio (PSRR): 78dB@(1kHz); Dropout Voltage: 450mV@(1A); standby current: 100uA; Feature: ESD Protection；Low ESR；Thermal Protection(TSD)；Under-voltage Lockout；Overcurrent Protection(OCP)；With ability; Operating Temperature: -40℃~+125℃; Output Polarity: Positive electrode; Number of Outputs: 1
U2 = TPS62143RGTR: Function:Step-down type Output Type:Fixed Input Voltage:3V~17V Input Voltage:3V~17V Output Voltage:5V Output Voltage:5V Output Current:2A Switching Frequency:2.5MHz Switching Frequency:2.5MHz Operating Temperature:-40℃~+85℃@(TA) Operating Temperature:-40℃; Supplier Part: C2070702; Manufacturer: TI(德州仪器); Supplier Footprint: TQFN-16-EP(3x3); JLCPCB Part Class: Extended Part; Datasheet: https://www.ti.com/cn/lit/gpn/tps62140; Supplier: LCSC; Function: Step-down type; Output Type: Fixed; Input Voltage: 3V~17V; Output Voltage: 5V; Output Current: 2A; Switching Frequency: 2.5MHz; Operating Temperature: -40℃~+85℃@(TA); Synchronous Rectification: Yes; Number of Outputs: 1; Topology: Step-down; Switch tube (built-in/external): Built-in
U3 = TPS7A3001DGNR: LCSC Part Name: 具有使能功能的 200mA、低噪声、高 PSRR、负电压、可调节低压降稳压器; Supplier Part: C33835; Manufacturer: TI(德州仪器); Supplier Footprint: HVSSOP-8; JLCPCB Part Class: Extended Part; Datasheet: https://www.ti.com/cn/lit/gpn/tps7a30; Supplier: LCSC; Output Type: Adjustable; Voltage - Supply: 35V; Output Voltage: 1.18V~33V; Output Current: 200mA; Power Supply Rejection Ratio (PSRR): 72dB@(120Hz); Voltage Dropout: 600mV@(200mA); standby current: 100uA; Features: ESD Protection；Low ESR；Thermal Protection(TSD)；Overcurrent Protection(OCP)；With ability; Operating Temperature: -40℃~+125℃; Output Configuration: Negative electrode; Number of Outputs: 1
U4 = LP5907MFX-3.3/NOPB: Output Type:Fixed Maximum Input Voltage:5.5V Output Voltage:3.3V Output Voltage:3.3V Output Current:250mA Power Supply Rejection Ratio (PSRR):90dB@(100Hz)；60dB@(100kHz) Dropout Voltage:250mV@(250mA) standby current:25uA Feature:ESD Protection；Short-Circui; LCSC Part Name: 具有低 IQ 和使能功能的 250mA、低噪声、高 PSRR、超低压降稳压器; Supplier Part: C80670; Manufacturer: TI(德州仪器); Supplier Footprint: SOT-23-5; JLCPCB Part Class: Extended Part; Datasheet: https://www.ti.com/cn/lit/gpn/lp5907; Supplier: LCSC; Output Type: Fixed; Maximum Input Voltage: 5.5V; Output Voltage: 3.3V; Output Current: 250mA; Power Supply Rejection Ratio (PSRR): 90dB@(100Hz)；60dB@(100kHz); Dropout Voltage: 250mV@(250mA); standby current: 25uA; Feature: ESD Protection；Short-Circuit  Protection；Automatic Discharge Function；Low ESR；Thermal Protection(TSD)；Under-voltage Lockout；With ability; Operating Temperature: -40℃~+125℃; Output Polarity: Positive electrode; Number of Outputs: 1
U5 U12 = NCV7240BDPR2G: Supplier Part: C603983; Manufacturer: onsemi(安森美); Supplier Footprint: SSOP-24-150mil; JLCPCB Part Class: Extended Part; Datasheet: https://atta.szlcsc.com/upload/public/pdf/source/20210601/C603983_800A83F294C15D65E75AA1CB4C37B992.pdf; Supplier: LCSC
U6 = STM32F070F6P6: CPU Core:ARM-M0 CPU Maximum Speed:48MHz CPU Bit Width:32bit Program Storage Size:32KB Program Memory Type:FLASH Number of I/O:15 ADC (Bit):12bit Voltage - Supply:2.4V~3.6V Voltage - Supply:2.4V~3.6V Applications:-; LCSC Part Name: 主流ARM Cortex-M0超值系列MCU，具有至多32 KB Flash、48 MHz CPU和USB功能; Supplier Part: C86951; Manufacturer: ST(意法半导体); Supplier Footprint: TSSOP-20; JLCPCB Part Class: Extended Part; Datasheet: https://item.szlcsc.com/datasheet/STM32F070F6P6/88128.html; Supplier: LCSC; CPU Core: ARM-M0; CPU Maximum Speed: 48MHz; CPU Bit Width: 32bit; Program Storage Size: 32KB; Program Memory Type: FLASH; Number of I/O: 15; ADC (Bit): 12bit; Voltage - Supply: 2.4V~3.6V
U7-U11 U13 = OPA4187IDR: Number of Circuits:Quad Gain Bandwidth Product(GBP):550kHz Current - Input Bias(Ib):100pA Voltage - Input Offset(Vos):1uV Slew Rate(SR):0.2V/us -3db Bandwidth(G=1):- Output Type:- Rail to Rail:- Operating Temperature:-40℃~+125℃ Operating Temperature:-40℃~; Supplier Part: C2060239; Manufacturer: TI(德州仪器); Supplier Footprint: SOIC-14; JLCPCB Part Class: Extended Part; Datasheet: https://www.ti.com/cn/lit/gpn/opa187; Supplier: LCSC; Number of Circuits: Quad; Gain Bandwidth Product(GBP): 550kHz; Current - Input Bias(Ib): 100pA; Voltage - Input Offset(Vos): 1uV; Slew Rate(SR): 0.2V/us; Operating Temperature: -40℃~+125℃
USB1 = TYPE-C16PIN: Connector Type:Type-C Standard:USB 3.1 Gender:Female Mounting Style:Horizontal attachment Number of Contacts:16P Number of Ports:1 Current Rating - Power (Max):3A Operating Temperature Range:-40℃~+85℃ Operating Temperature Range:-40℃~+85℃ Rated Voltage (M; LCSC Part Name: Type-C 母 卧贴; Supplier Part: C393939; Manufacturer: SHOU HAN(首韩); Supplier Footprint: SMD; JLCPCB Part Class: Extended Part; Datasheet: https://atta.szlcsc.com/upload/public/pdf/source/20190521/C393939_7B9043D4CF1026AF443AB60D91FBCD5C.pdf; Supplier: LCSC; Connector Type: Type-C; Standard: USB 3.1; Gender: Female; Mounting Style: Horizontal attachment; Number of Contacts: 16P; Number of Ports: 1; Current Rating - Power (Max): 3A; Operating Temperature Range: -40℃~+85℃; Rated Voltage (Max): 30V; Connect-Disconnect Life: 10,000 times; Core Colour: Black
X1 = 3225 8M 12PF 10PPM: LCSC Part Name: 8MHz ±10ppm 12pF; Supplier Part: C5181478; Manufacturer: SOSET(索斯特); Supplier Footprint: SMD3225-4P; JLCPCB Part Class: Extended Part; Datasheet: https://item.szlcsc.com/datasheet/3225%25208M%252012PF%252010PPM/5840829.html; Supplier: LCSC; Normal temperature Frequency Tolerance: ±10ppm; Load Capacitance: 12pF; Frequency Stability: ±30ppm; Operating Temperature: -20℃~+70℃
CN5 = BH254V-20P: Connector Type:简牛座 Pitch:- Structure:2x10P Current Rating (Max):3A Voltage Rating (Max):250V Holder Type:Straight Row Spacing:2.54mm Number of Rows:2 Pin Number in each Row:10 Contact Material:- Contact Plating:- Operating Temperature Range:-40℃~+105℃ Ope; LCSC Part Name: 2x10P 排数:2 每排P数:10; Supplier Part: C492444; Manufacturer: XFCN(兴飞); Supplier Footprint: 插件,P=2.54mm; JLCPCB Part Class: Extended Part; Datasheet: https://atta.szlcsc.com/upload/public/pdf/source/20200312/C492444_4AABE2FC4F6BE8226B85135616AF0092.pdf; Supplier: LCSC; Connector Type: 简牛座; Structure: 2x10P; Current Rating (Max): 3A; Voltage Rating (Max): 250V; Holder Type: Straight; Row Spacing: 2.54mm; Number of Rows: 2; Pin Number in each Row: 10; Operating Temperature Range: -40℃~+105℃
R53 R54 R57 R58 = SCR0603F40K: Type:Thick Film Resistors Resistance: Tolerance:±1% Tolerance:±1% Power(Watts): Overload Voltage (Max): Operating Temperature Range:-55℃~+155℃ Operating Temperature Range:-55℃~+155℃; LCSC Part Name: 40kΩ ±1%; Supplier Part: C3016445; Manufacturer: VO(翔胜); Supplier Footprint: 0603; JLCPCB Part Class: Extended Part; Datasheet: https://atta.szlcsc.com/upload/public/pdf/source/20220513/247AF9639BA21CF93567DC289CCC6A22.pdf; Supplier: LCSC; Type: Thick Film Resistors; Tolerance: ±1%; Operating Temperature Range: -55℃~+155℃
R66 R67 R70 R71 = RC0603FR-07100KL: LCSC Part Name: 厚膜电阻 100kΩ ±1% 100mW; Supplier Part: C14675; Manufacturer: YAGEO(国巨); Supplier Footprint: 0603; JLCPCB Part Class: Extended Part; Datasheet: https://atta.szlcsc.com/upload/public/pdf/source/20140324/1457707028752.pdf; Supplier: LCSC; Type: Thick Film Resistors; Tolerance: ±1%; Temperature Coefficient: ±100ppm/℃; Operating Temperature Range: -55℃~+155℃
R74 = RTT031654FTP: LCSC Part Name: 厚膜电阻 1.65MΩ ±1% 100mW; Supplier Part: C166893; Manufacturer: RALEC(旺诠); Supplier Footprint: 0603; JLCPCB Part Class: Extended Part; Datasheet: https://atta.szlcsc.com/upload/public/pdf/source/20180928/C303758_52AE496EA05AD4D633595C32F5A0EBAF.pdf; Supplier: LCSC; Type: Thick Film Resistors; Tolerance: ±1%; Temperature Coefficient: ±100ppm/℃; Operating Temperature Range: -55℃~+155℃
SW1 = DSWB01LHGET_C25503176: Supplier Part: C25503176; Manufacturer: HanElectricity(瀚源); Supplier Footprint: 插件,4.1x9.9mm; JLCPCB Part Class: Extended Part; Datasheet: https://atta.szlcsc.com/upload/public/pdf/source/20240704/0E5350B7B50D7841EE7CE71A08CBE5E5.pdf; Supplier: LCSC
SW2 = DSWB02LHGET: Type:平拨,凸起式 Circuit:SPST Number of Positions:2Bit Lead Pitch:2.54mm Operating Life:- Color:Red; LCSC Part Name: 拨码开关,平拨开关,DSWB02LHGET; Supplier Part: C99421; Manufacturer: YE; Supplier Footprint: 插件; JLCPCB Part Class: Extended Part; Datasheet: https://atta.szlcsc.com/upload/public/pdf/source/20230906/EFD9230F686161BBBCD1B62855702D44.pdf; Supplier: LCSC; Type: 平拨,凸起式; Circuit: SPST; Number of Positions: 2Bit; Lead Pitch: 2.54mm; Color: Red
U14 = PZ127-2-18-Z: Pin Structure:2x18P Pitch:1.27mm Row Spacing:1.27mm Circluar Pins/Square Pins:Policy Mounting Type:Direct Insert Number of Rows:Double Row Number of Pins:36P Current Rating (Max):1A Voltage Rating (Max):500V Length of Mating Pin:3.8mm Insulation Height:1m; LCSC Part Name: 2x18P 间距:1.27mm 方针 直插; Supplier Part: C5372822; Manufacturer: HCTL(华灿天禄); Supplier Footprint: 插件,P=1.27mm; JLCPCB Part Class: Extended Part; Datasheet: https://atta.szlcsc.com/upload/public/pdf/source/20240702/A94E5E2C58EC168531668174128D95E4.pdf; Supplier: LCSC; Pin Structure: 2x18P; Pitch: 1.27mm; Row Spacing: 1.27mm; Circluar Pins/Square Pins: Policy; Mounting Type: Direct Insert; Number of Rows: Double Row; Number of Pins: 36P; Current Rating (Max): 1A; Voltage Rating (Max): 500V; Length of Mating Pin: 3.8mm; Insulation Height: 1mm; Length of End Connection Pin: 2.4mm; Contact Material: Brass; Operating Temperature Range: -40℃~+105℃; Soldering Temperature(Max): 260℃@10S; Color: Black

## Nets
3V3: C14.1 C16.1 C17.2 C18.2 CN2.3 LED2.2(A) TP4.1 U4.5(OUT) U5.13(VDD) U6.5(VDDA) U6.16(VDD) U12.13(VDD)
5V: C3.2 C6.2 C13.1 K1.1 K2.1 K3.1 K4.1 K5.1 K6.1 K7.1 K8.1 K9.1 K10.1 K11.1 K12.1 K13.1 L1.2 LED1.2(A) R9.2 R10.2 R11.2 R12.2 R13.2 R14.2 R15.2 R16.2 R61.2 R62.2 R63.2 R64.2 R65.2 TP2.1 U2.14(VOS) U4.1(IN) U4.3(EN) U5.24(VDDA) U12.24(VDDA)
+9V: C5.2 C7.2 C19.2 C20.2 C29.2 C30.2 C37.2 C38.2 C47.2 C48.2 C55.2 C56.2 C57.2 C58.2 LED3.2(A) R1.2 TP1.1 U1.1(OUT) U7.4(V+) U8.4(V+) U9.4(V+) U10.4(V+) U11.4(V+) U13.4(V+)
+12V: C1.1 C2.2 C4.2 CN1.1 U1.5(EN) U1.8(IN) U2.10(AVIN) U2.11(PVIN) U2.12(PVIN) U2.13(EN)
-9V: C11.2 C12.2 C19.1 C20.1 C29.1 C30.1 C37.1 C38.1 C47.1 C48.1 C55.1 C56.1 C57.1 C58.1 LED4.1(K) R7.2 TP3.1 U3.1(OUT) U7.11(V-) U8.11(V-) U9.11(V-) U10.11(V-) U11.11(V-) U13.11(V-)
-12V: C10.2 CN1.3 U3.5(EN) U3.8(IN)
GND: C1.2 C2.1 C3.1 C4.1 C6.1 C7.1 C8.1 C9.1 C10.1 C12.1 C13.2 C14.2 C15.1 C16.2 C17.1 C18.1 C23.1 C24.2 C26.1 C27.1 C33.1 C34.2 C36.1 C41.1 C42.2 C44.1 C45.1 C51.1 C52.2 C54.1 CN1.2 CN2.5 CN2.7 CN3.2 CN4.2 CN6.2 R2.1 R3.1 R4.1 R5.1 R6.1 R8.1 R17.2 R18.1 R19.1 R20.1 R55.1 R56.1 R59.1 R60.1 R68.1 R69.1 R72.1 R73.1 R75.1 SW2.2 U1.4(GND) U1.9(PwPd) U2.5(FB) U2.6(AGND) U2.7(FSW) U2.8(DEF) U2.15(PGND) U2.16(PGND) U2.17(EP) U3.4(GND) U3.9(EP) U4.2(GND) U5.1(GND) U5.2(GND) U5.11(GND) U5.12(GND) U5.14(IN4) U5.15(IN3) U5.16(IN2) U5.17(IN1) U5.18(LHI) U6.15(VSS) U8.12(+IND) U10.12(+IND) U12.1(GND) U12.2(GND) U12.11(GND) U12.12(GND) U12.14(IN4) U12.15(IN3) U12.16(IN2) U12.17(IN1) U12.18(LHI) U14.1 U14.36 USB1.1(SHELL) USB1.2(SHELL) USB1.3(SHELL) USB1.4(SHELL) USB1.A1B12(GND) USB1.B1A12(GND)
VBUS: USB1.A4B9(VBUS) USB1.B4A9(VBUS)
A1: K9.3 K11.4 K12.4 R66.2
A1_D: K9.4 U11.1(OUTA) U11.2(-INA)
A2: K10.3 K13.4 R70.2
A2_D: K10.4 U11.13(-IND) U11.14(OUTD)
AMP_CH1: K11.7 U14.3
AMP_CH4: K13.7 U14.6
AMP_CH8: K13.2 U14.10
AMP_CH9: K12.7 U14.11
AMP_CH13: K12.2 U14.15
AMP_CH16: K11.2 U14.18
AMP_CH17: U13.1(OUTA) U13.2(-INA) U14.19
AMP_CH18: U13.13(-IND) U13.14(OUTD) U14.20
AMP_CH19: U13.6(-INB) U13.7(OUTB) U14.21
AMP_CH20: U13.8(OUTC) U13.9(-INC) U14.22
AMP_CH22: R74.1 R75.2 U14.24
C1: K9.6 K11.5 K12.5 R67.2
C1_D: K9.5 U11.6(-INB) U11.7(OUTB)
C2: K10.6 K13.5 R71.2
C2_D: K10.5 U11.8(OUTC) U11.9(-INC)
CH1_2HZ_A: C21.2 K7.3 U7.6(-INB) U7.7(OUTB)
CH1_8HZ_A: C25.2 K6.3 U7.1(OUTA) U7.2(-INA)
CH1_40HZ_A: C22.1 K5.3 U7.8(OUTC) U7.9(-INC)
CH1_130HZ_A: C28.1 K4.3 U7.13(-IND) U7.14(OUTD)
CH1_530HZ_A: C31.2 K3.3 U8.6(-INB) U8.7(OUTB)
CH1_1030HZ_A: C35.2 K2.3 U8.1(OUTA) U8.2(-INA)
CH1_2030HZ_A: C32.1 K1.3 U8.8(OUTC) U8.9(-INC)
CH1_A: K8.2 R21.1 R24.2 R26.2 R27.1 R29.1 R32.2 R35.1
CH1_FILTER_A: K1.4 K2.4 K3.4 K4.4 K5.4 K6.4 K7.4 K8.4 K9.2 R34.2 R53.2
CH1_FILTER_C: K9.7 R33.1 R57.2 U8.14(OUTD)
CH1_INPUT: CN3.1 K8.3
CH2_2HZ_A: C39.2 K7.6 U9.6(-INB) U9.7(OUTB)
CH2_8HZ_A: C43.2 K6.6 U9.1(OUTA) U9.2(-INA)
CH2_40HZ_A: C40.1 K5.6 U9.8(OUTC) U9.9(-INC)
CH2_130HZ_A: C46.1 K4.6 U9.14(OUTD)
CH2_530HZ_A: C49.2 K3.6 U10.6(-INB) U10.7(OUTB)
CH2_1030HZ_A: C53.2 K2.6 U10.1(OUTA) U10.2(-INA)
CH2_2030HZ_A: C50.1 K1.6 U10.8(OUTC) U10.9(-INC)
CH2_A: K8.7 R37.1 R40.2 R42.2 R43.1 R45.1 R48.2 R51.1
CH2_FILTER_A: K1.5 K2.5 K3.5 K4.5 K5.5 K6.5 K7.5 K8.5 K10.2 R50.2 R54.2
CH2_FILTER_C: K10.7 R49.1 R58.2 U10.14(OUTD)
CH2_INPUT: CN4.1 K8.6
CS1: U5.23(CSB) U6.9(PA3)
CS2: U6.10(PA4) U12.23(CSB)
EN: U5.21(EN) U6.14(PB1) U12.21(EN)
G: CN5.19 CN5.20 SW1.2 SW2.4
NRST: CN2.12 U6.4(NRST)
R: CN5.17 CN5.18 SW1.1(A1) SW2.3
REF: CN6.1 SW2.1 U14.2 U14.35
REL1: K11.8 LED13.1(K) U12.3(OUT1)
REL2: K12.8 LED14.1(K) U12.4(OUT2)
REL3: K13.8 LED15.1(K) U12.5(OUT3)
REL4: K9.8 LED17.1(K) U12.6(OUT4)
REL5: K10.8 LED16.1(K) U12.7(OUT5)
RELAY1: K8.8 LED5.1(K) U5.3(OUT1)
RELAY2: K7.8 LED7.1(K) U5.4(OUT2)
RELAY3: K6.8 LED6.1(K) U5.5(OUT3)
RELAY4: K5.8 LED9.1(K) U5.6(OUT4)
RELAY5: K4.8 LED8.1(K) U5.7(OUT5)
RELAY6: K3.8 LED11.1(K) U5.8(OUT6)
RELAY7: K2.8 LED10.1(K) U5.9(OUT7)
RELAY8: K1.8 LED12.1(K) U5.10(OUT8)
SCK: U5.20(SCLK) U6.11(PA5) U12.20(SCLK)
SEN_CH1: CN5.1 K11.6
SEN_CH2: CN5.2 U14.4
SEN_CH3: CN5.3 U14.5
SEN_CH4: CN5.4 K13.6
SEN_CH5: CN5.5 U14.7
SEN_CH6: CN5.6 U14.8
SEN_CH7: CN5.7 U14.9
SEN_CH8: CN5.8 K13.3
SEN_CH9: CN5.9 K12.6
SEN_CH10: CN5.10 U14.12
SEN_CH11: CN5.11 U14.13
SEN_CH12: CN5.12 U14.14
SEN_CH13: CN5.13 K12.3
SEN_CH14: CN5.14 U14.16
SEN_CH15: CN5.15 U14.17
SEN_CH16: CN5.16 K11.3
SI: U5.22(SI) U6.13(PA7) U12.22(SI)
SO: U5.19(SO) U6.12(PA6) U12.19(SO)
SWCLK: CN2.6 U6.20(PA14)
SWDIO: CN2.4 U6.19(PA13)
SWO: CN2.8
SYNC: R74.2 U6.8(PA2)
USB_N: U6.17(PA9[PA11]) USB1.A7(DN1) USB1.B7(DN2)
USB_P: U6.18(PA10[PA12]) USB1.A6(DP1) USB1.B6(DP2)
$1N532: C8.2 U1.6(NR/SS)
$1N675: C5.1 R1.1 R2.2 U1.2(FB)
$1N1417: C11.1 R7.1 R8.2 U3.2(FB)
$1N1423: C15.2 U3.6(NRSS)
$1N2713: C9.2 U2.9(SS/TR)
$1N2718: L1.1 U2.1(SW) U2.2(SW) U2.3(SW)
$1N3279: LED2.1(K) R4.2
$1N3737: LED1.1(K) R3.2
$1N3816: LED3.1(K) R5.2
$1N3858: LED4.2(A) R6.2
$1N4254: R17.1 U6.1(BOOT0)
$1N4488: R20.2 USB1.A5(CC1)
$1N4491: R19.2 USB1.B5(CC2)
$1N4637: CN2.11 R18.2
$1N5843: LED6.2(A) R11.1
$1N5844: LED8.2(A) R13.1
$1N5845: LED11.2(A) R14.1
$1N5846: LED9.2(A) R12.1
$1N5847: LED7.2(A) R10.1
$1N5848: LED5.2(A) R9.1
$1N6791: C24.1 R23.1 U7.10(+INC)
$1N6807: C21.1 R21.2 R22.1
$1N6808: C23.2 R22.2 U7.5(+INB)
$1N6809: C27.2 R28.2 U7.3(+INA)
$1N6810: C25.1 R27.2 R28.1
$1N7802: C22.2 R23.2 R24.1
$1N7987: C28.2 R25.2 R26.1
$1N7993: C26.2 R25.1 U7.12(+IND)
$1N9202: C32.2 R31.2 R32.1
$1N9216: C34.1 R31.1 U8.10(+INC)
$1N9241: C31.1 R29.2 R30.1
$1N9249: C33.2 R30.2 U8.5(+INB)
$1N9253: C36.2 R36.2 U8.3(+INA)
$1N9257: C35.1 R35.2 R36.1
$1N10515: LED10.2(A) R15.1
$1N10516: LED12.2(A) R16.1
$1N10708: R33.2 R34.1 U8.13(-IND)
$1N12227: C45.2 R44.2 U9.3(+INA)
$1N12229: C43.1 R43.2 R44.1
$1N12238: C42.1 R39.1 U9.10(+INC)
$1N12241: C41.2 R38.2 U9.5(+INB)
$1N12243: C39.1 R37.2 R38.1
$1N12255: C40.2 R39.2 R40.1
$1N12267: C44.2 R41.1 U9.12(+IND)
$1N12269: C46.2 R41.2 R42.1
$1N12283: C54.2 R52.2 U10.3(+INA)
$1N12285: C53.1 R51.2 R52.1
$1N12298: C52.1 R47.1 U10.10(+INC)
$1N12301: C51.2 R46.2 U10.5(+INB)
$1N12303: C49.1 R45.2 R46.1
$1N12314: C50.2 R47.2 R48.1
$1N12337: R49.2 R50.1 U10.13(-IND)
$1N24901: U6.2(PF0/OSC_IN) X1.1
$1N24910: U6.3(PF1/OSC_OUT) X1.3
$2N474: R53.1 R55.2 U11.3(+INA)
$2N479: R57.1 R59.2 U11.5(+INB)
$2N485: R54.1 R56.2 U11.12(+IND)
$2N486: R58.1 R60.2 U11.10(+INC)
$2N935: R66.1 R68.2 U13.3(+INA)
$2N936: R70.1 R72.2 U13.5(+INB)
$2N939: R67.1 R69.2 U13.12(+IND)
$2N940: R71.1 R73.2 U13.10(+INC)
$2N4173: LED13.2(A) R61.1
$2N4174: LED14.2(A) R62.1
$2N4175: LED15.2(A) R63.1
$2N4176: LED17.2(A) R64.1
$2N4177: LED16.2(A) R65.1

Not connected (* = marked no-connect by the designer): CN2 1 2 9 10 13 14; K1 2 7; K2 2 7; K3 2 7; K4 2 7; K5 2 7; K6 2 7; K7 2 7; U1 3(NC) 7(DNC); U2 4(PG)*; U3 3(NC) 7(DNC); U4 4(N/C)*; U6 6(PA0)* 7(PA1)*; U9 13(-IND); U12 8(OUT6) 9(OUT7) 10(OUT8); U14 23 25 26 27 28 29 30 31 32 33 34; USB1 A8(SBU1)* B8(SBU2)*; X1 2(GND) 4(GND)
